# EAGLE design Nu6550 (EAGLE 7.7.0)
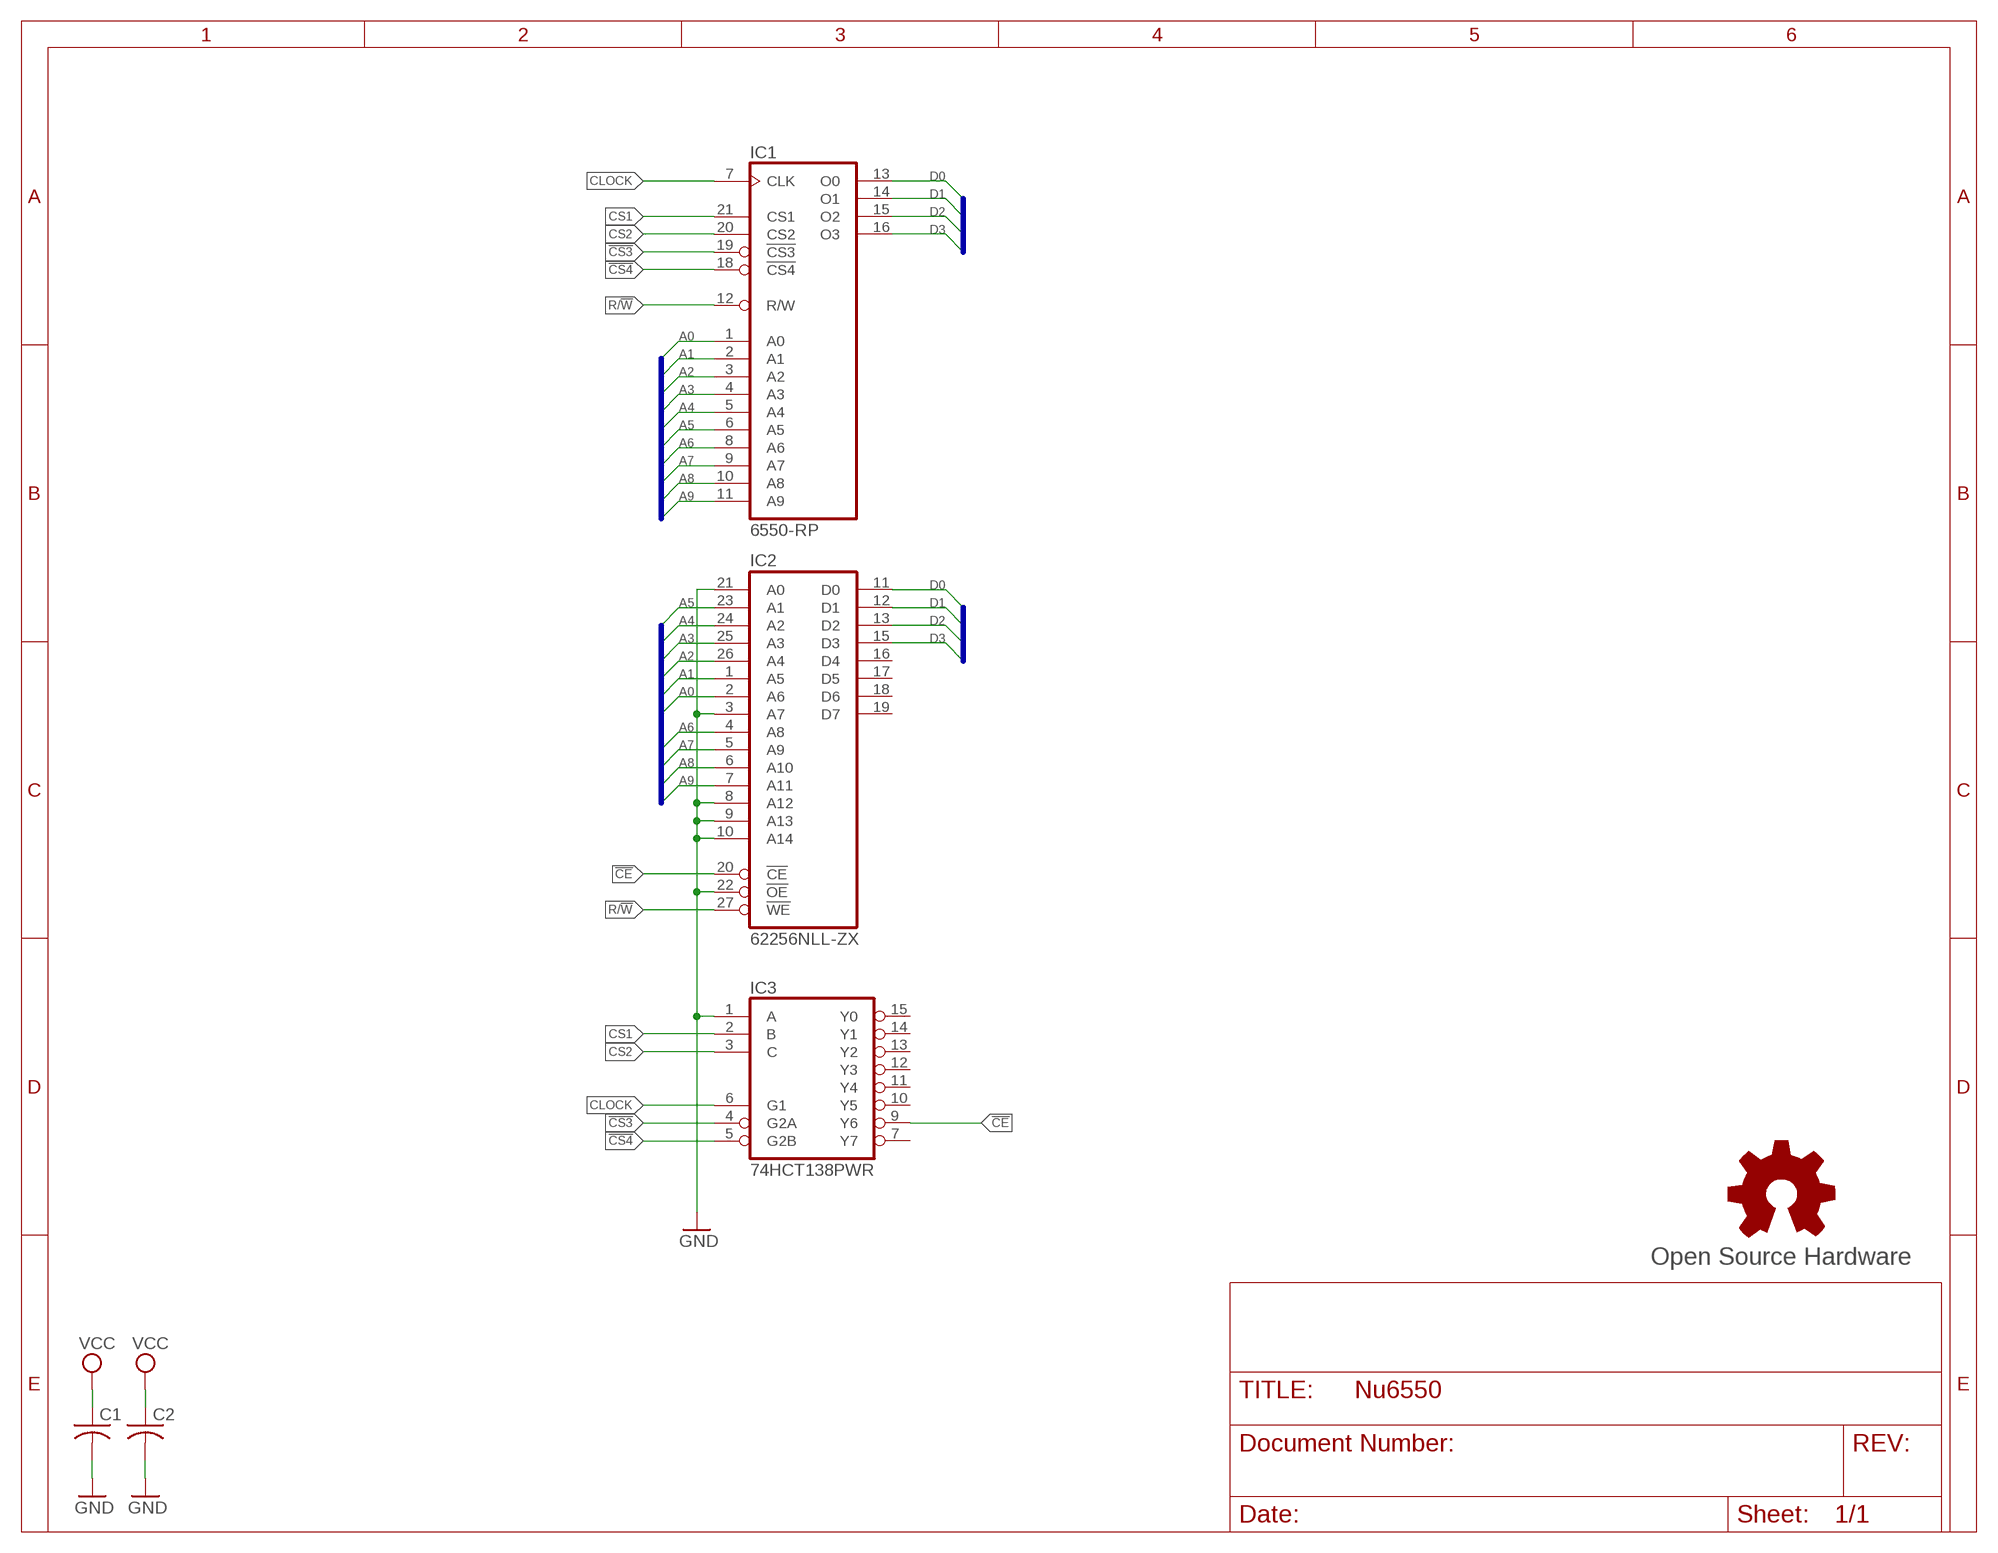
[diagram p0: schematic, sheet 1]

## Parts
C1  C-USC0402  [C0402]
C2  C-USC0402  [C0402]
GOLD_ORB_SM1  Open Source Hardware  OSHWLOGOLOGO5MM  [OSHW_5MM]
IC1  6550-RP  [DIL22/4-ROUNDPAD]
IC2  62256NLL-ZX  JEDEC_32KB_SRAMZX  [TSOP1-28]
IC3  74HCT138PWR  [TSSOP16]

## Nets
!CE: IC2.20(!CE) IC3.9(Y6)
!CS3: IC1.19(!CS3) IC3.4(G2A)
!CS4: IC1.18(!CS4) IC3.5(G2B)
A0: IC1.1(A0) IC2.2(A6)
A1: IC1.2(A1) IC2.1(A5)
A2: IC1.3(A2) IC2.26(A4)
A3: IC1.4(A3) IC2.25(A3)
A4: IC1.5(A4) IC2.24(A2)
A5: IC1.6(A5) IC2.23(A1)
A6: IC1.8(A6) IC2.4(A8)
A7: IC1.9(A7) IC2.5(A9)
A8: IC1.10(A8) IC2.6(A10)
A9: IC1.11(A9) IC2.7(A11)
CLOCK: IC1.7(CLK) IC3.6(G1)
CS1: IC1.21(CS1) IC3.2(B)
CS2: IC1.20(CS2) IC3.3(C)
D0: IC1.13(O0) IC2.11(D0)
D1: IC1.14(O1) IC2.12(D1)
D2: IC1.15(O2) IC2.13(D2)
D3: IC1.16(O3) IC2.15(D3)
GND: C1.2 C2.2 IC2.3(A7) IC2.8(A12) IC2.9(A13) IC2.10(A14) IC2.21(A0) IC2.22(!OE) IC3.1(A)
R/!W: IC1.12(R/W) IC2.27(!WE)
VCC: C1.1 C2.1
Unconnected: IC2.16(D4) IC2.17(D5) IC2.18(D6) IC2.19(D7) IC3.7(Y7) IC3.10(Y5) IC3.11(Y4) IC3.12(Y3) IC3.13(Y2) IC3.14(Y1) IC3.15(Y0)

## Buses
A[0..9]
D[0..3]

## Power pins joined to a net without a drawn wire
GND: IC1.22(GND) IC2.14(GND) IC3.8(GND)
VCC: IC1.17(VCC) IC2.28(VCC) IC3.16(VCC)

## Library data of the parts
C1 C2 = resistor:C-US: CAPACITOR, American symbol
GOLD_ORB_SM1 = oshw:OSHWLOGO: The OSHW logo for PCB layout
IC1 = commodore:6550
IC2 = memory-jedec-jlb:JEDEC_32KB_SRAM: MEMORY
IC3 = 74xx-us-jlb:74*138: 3-line to 8-line DECODER/DEMULTIPLEXER

## Board
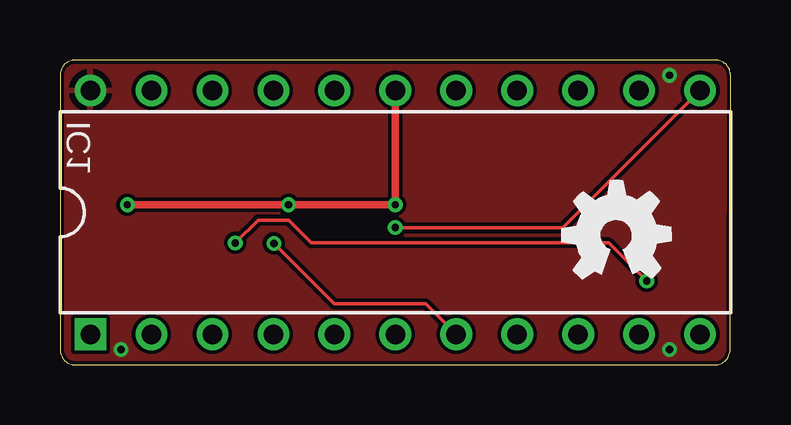
[diagram p1: board, top side]
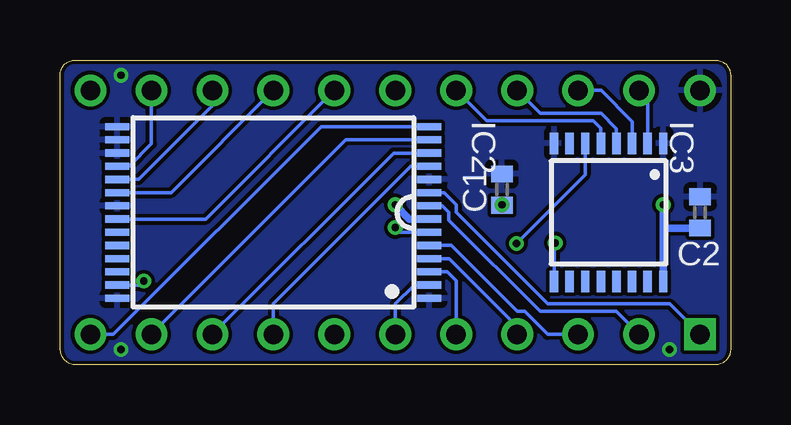
[diagram p2: board, bottom side, seen from below]

Size 27.94 x 12.7 mm. Coordinates in mm from the lower left corner, seen from the top.
Outline: 0,12.06 0,0.64 arc90 0.64,0 27.29,0 arc90 27.92,0.63 27.94,12.06 arc90 27.3,12.7 0.64,12.7 arc90 0,12.06
Copper layers (1*16): Top 0.035mm / dielectric 1.5mm / Bottom 0.035mm
Design rules "hackvana *": minimum track width 6mil, minimum drill 0.3mm, track to track 6mil, track to pad 6mil, pad to pad 6mil, via to via 6mil, smd to smd 0mil, copper to edge 6mil, drill to drill 6mil, minimum pad ring 10mil, minimum via ring 6mil, stop-mask expansion 2mil, vias tented up to drill 100mil, thermal gap 10mil

### Footprints (pad centres in the part's own frame; a part is rotated, then mirrored left to right if it is on the bottom)
C0402 = smd 0.7 x 0.9: 1 -0.65,0; 2 0.65,0
DIL22/4-ROUNDPAD = drill 0.813 square: 1 -12.7,-5.08 | drill 0.813: 2 -10.16,-5.08; 3 -7.62,-5.08; 4 -5.08,-5.08; 5 -2.54,-5.08; 6 0,-5.08; 7 2.54,-5.08; 8 5.08,-5.08; 9 7.62,-5.08; 10 10.16,-5.08; 11 12.7,-5.08; 12 12.7,5.08; 13 10.16,5.08; 14 7.62,5.08; 15 5.08,5.08; 16 2.54,5.08; 17 0,5.08; 18 -2.54,5.08; 19 -5.08,5.08; 20 -7.62,5.08; 21 -10.16,5.08; 22 -12.7,5.08
TSOP1-28 = smd 1 x 0.3: 1 -6.5,-0.275; 2 -6.5,-0.825; 3 -6.5,-1.375; 4 -6.5,-1.925; 5 -6.5,-2.475; 6 -6.5,-3.025; 7 -6.5,-3.575; 8 6.5,-3.575; 9 6.5,-3.025; 10 6.5,-2.475; 11 6.5,-1.925; 12 6.5,-1.375; 13 6.5,-0.825; 14 6.5,-0.275; 15 6.5,0.275; 16 6.5,0.825; 17 6.5,1.375; 18 6.5,1.925; 19 6.5,2.475; 20 6.5,3.025; 21 6.5,3.575; 22 -6.5,3.575; 23 -6.5,3.025; 24 -6.5,2.475; 25 -6.5,1.925; 26 -6.5,1.375; 27 -6.5,0.825; 28 -6.5,0.275
TSSOP16 = smd 0.9 x 0.35: 1 -2.875,2.275; 2 -2.875,1.625; 3 -2.875,0.975; 4 -2.875,0.325; 5 -2.875,-0.325; 6 -2.875,-0.975; 7 -2.875,-1.625; 8 -2.875,-2.275; 9 2.875,-2.275; 10 2.875,-1.625; 11 2.875,-0.975; 12 2.875,-0.325; 13 2.875,0.325; 14 2.875,0.975; 15 2.875,1.625; 16 2.875,2.275

### Placement (x,y rotation side)
C1  9.53,7.3 90 bottom
C2  1.27,6.35 90 bottom
GOLD_ORB_SM1  23.18,5.4 0 top
IC1  13.97,6.35 0 top
IC2  19.05,6.35 180 bottom
IC3  5.08,6.35 270 bottom

### Tracks (layer width: path | path; a pad name or v marks a point on that pad's centre or on a via)
!CE  (via drill 0.3)
  Top 0.152: v24.45,3.49 22.86,5.08 10.48,5.08 9.53,6.03 8.26,6.03 v7.3,5.08
  Bottom 0.152: IC2.20 24.61,3.33 v24.45,3.49 | v7.3,5.08 7.36,5.03 IC3.9
!CS3
  Bottom 0.152: IC3.4 4.75,9.84 5.4,10.48 7.94,10.48 IC1.19
!CS4
  Bottom 0.152: IC3.5 5.41,9.85 5.71,10.16 10.16,10.16 IC1.18
A0
  Bottom 0.152: IC2.2 11.94,7.17 11.43,6.67 11.43,6.35 7.62,2.54 2.54,2.54 IC1.1
A1
  Bottom 0.152: IC2.1 12.02,6.62 11.75,6.35 11.75,6.03 7.94,2.22 4.76,2.22 IC1.2
A2
  Bottom 0.152: IC2.26 11.64,4.97 8.89,2.22 8.57,2.22 7.62,1.27 IC1.3
A3
  Bottom 0.152: IC2.25 11.73,4.42 8.89,1.59 IC1.4
A4
  Bottom 0.152: IC2.24 11.81,3.88 11.43,3.49 IC1.5
A5
  Bottom 0.152: IC2.23 13.19,3.33 13.97,2.54 IC1.6
A6
  Bottom 0.152: IC2.4 13.31,8.28 19.05,2.54 IC1.8
A7
  Bottom 0.152: IC2.5 14.04,8.82 IC1.9
A8
  Bottom 0.152: IC2.6 16.02,9.38 IC1.10
A9
  Bottom 0.152: IC1.11 25.72,1.27 17.06,9.93 IC2.7
CLOCK  (via drill 0.3)
  Top 0.152: IC1.7 15.24,2.54 11.43,2.54 v8.91,5.06
  Bottom 0.152: IC3.6 6.05,7.92 v8.91,5.06
CS1
  Bottom 0.152: IC3.2 3.46,11.07 IC1.21
CS2
  Bottom 0.152: IC3.3 4.11,10.14 5.4,11.43 IC1.20
D0
  Bottom 0.152: IC1.13 24.13,9.21 25.06,8.28 IC2.11
D1
  Bottom 0.152: IC1.14 21.59,10.79 24.66,7.72 IC2.12
D2
  Bottom 0.152: IC2.13 23.3,7.17 IC1.15
D3
  Bottom 0.152: IC2.15 21.86,6.08 IC1.16
GND  (via drill 0.3)
  other vias: 2.54,0.64 25.4,0.64 25.4,12.06
  pour Bottom: 27.3,0 0.64,0 arc-90 0,0.64 0,12.06 arc-90 0.64,12.7 27.3,12.7 arc-90 27.94,12.06 27.94,0.64 arc-90
  pour Top: 27.3,0 0.64,0 arc-90 0,0.64 0,12.06 arc-90 0.64,12.7 27.3,12.7 arc-90 27.94,12.06 27.94,0.64 arc-90
R/!W  (via drill 0.3)
  Top 0.152: v13.97,5.71 20.95,5.71 IC1.12
  Bottom 0.152: IC2.27 13.78,5.53 v13.97,5.71
VCC  (via drill 0.3)
  Top 0.305: IC1.17 v13.97,6.67 v9.53,6.67 v2.81,6.67
  Bottom 0.305: C2.1 2.81,5.7 | 2.81,5.7 IC3.16 | IC2.28 13.38,6.08 v13.97,6.67 | 2.81,5.7 v2.81,6.67 | C1.1 v9.53,6.67